# Altium project OpenFRA_V1.PrjPcb
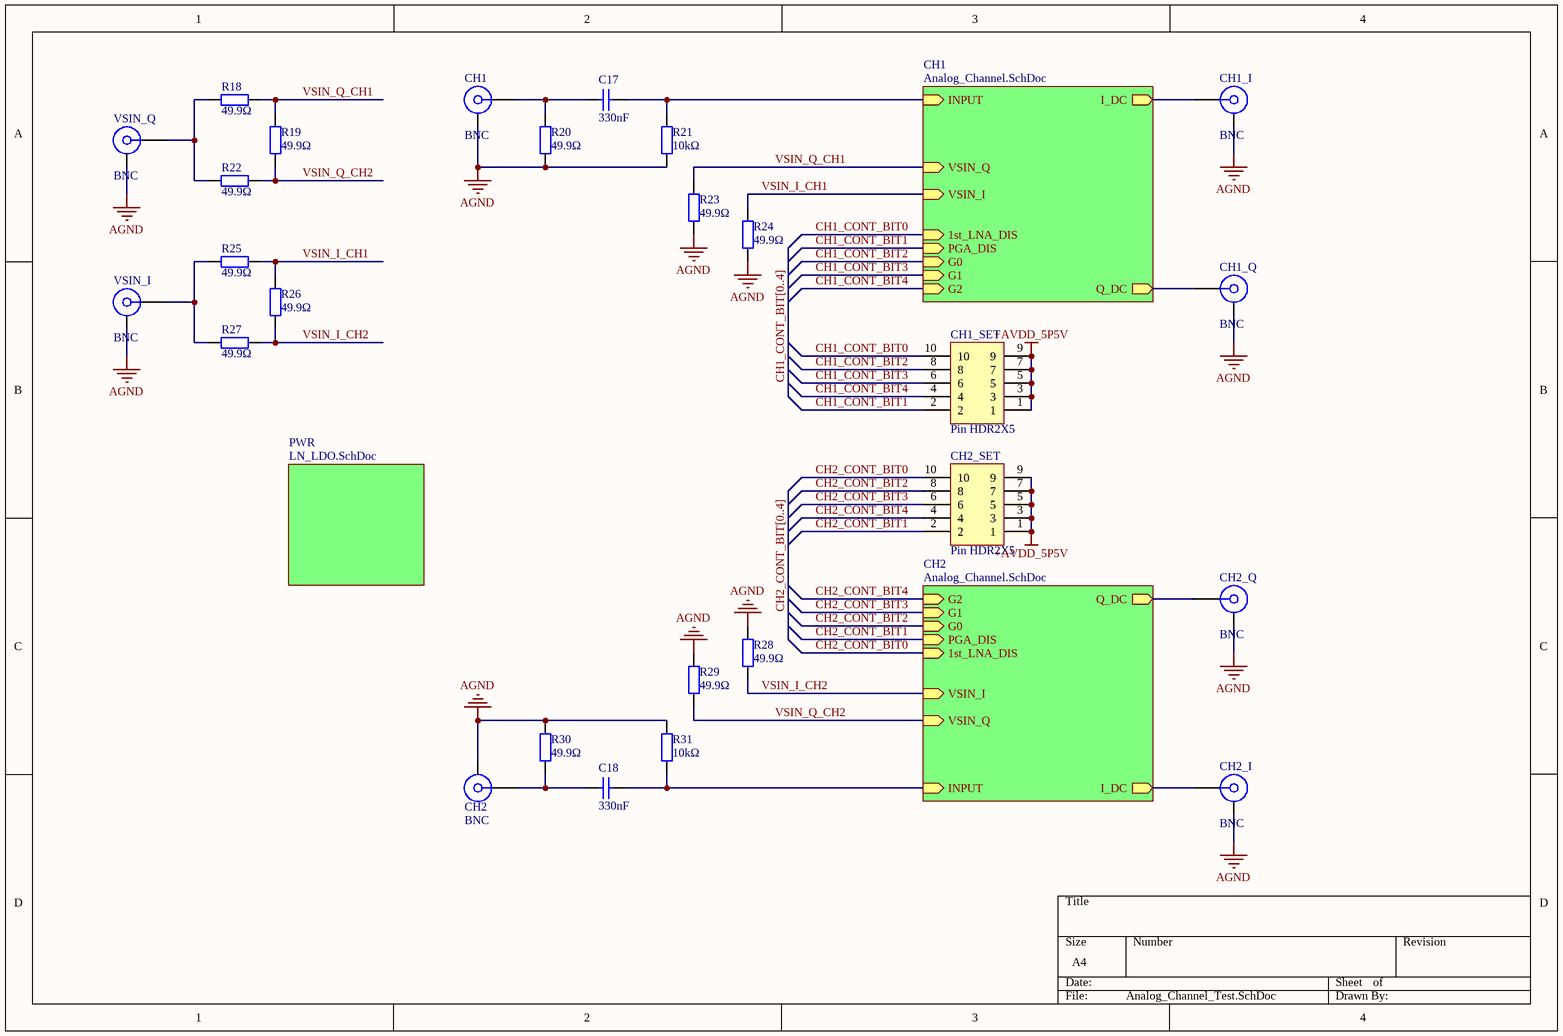
[diagram p0: Analog_Channel_Test.SchDoc]
7 sheets, 183 parts. Net scope: hierarchical (ports join the sheet entries above them; power ports are global).
Board files: PCB1.PcbDoc, PCB_AutoRoute.PcbDoc
Sheets:
  Analog_Channel_Test.SchDoc
    CH1 = Analog_Channel.SchDoc
      MIXER1 = AD835_Mixer.SchDoc
      MIXER2 = AD835_Mixer.SchDoc
      PGA1 = THS7001_PGA.SchDoc
      AMP1 = OPA847_LNA.SchDoc
    CH2 = Analog_Channel.SchDoc
      MIXER1 = AD835_Mixer.SchDoc
      MIXER2 = AD835_Mixer.SchDoc
      PGA1 = THS7001_PGA.SchDoc
      AMP1 = OPA847_LNA.SchDoc
    PWR = LN_LDO.SchDoc
  AD7768.SchDoc

## Sheet Analog_Channel_Test.SchDoc
size A4; SheetNumber: 1; SheetTotal: 7

### Parts
C17  330nF  [1206_C]
C18  330nF  [1206_C]
CH1  BNC  [BNC-TYCO_1-1337542-0]
CH1_I  BNC  [BNC-TYCO_1-1337542-0]
CH1_Q  BNC  [BNC-TYCO_1-1337542-0]
CH1_SET  Pin HDR2X5  [Pin HDR2X5/2.54mm-S]
CH2  BNC  [BNC-TYCO_1-1337542-0]
CH2_I  BNC  [BNC-TYCO_1-1337542-0]
CH2_Q  BNC  [BNC-TYCO_1-1337542-0]
CH2_SET  Pin HDR2X5  [Pin HDR2X5/2.54mm-S]
R18  49.9Ω  [0603_R]
R19  49.9Ω  [0603_R]
R20  49.9Ω  [0603_R]
R21  10kΩ  [0603_R]
R22  49.9Ω  [0603_R]
R23  49.9Ω  [0603_R]
R24  49.9Ω  [0603_R]
R25  49.9Ω  [0603_R]
R26  49.9Ω  [0603_R]
R27  49.9Ω  [0603_R]
R28  49.9Ω  [0603_R]
R29  49.9Ω  [0603_R]
R30  49.9Ω  [0603_R]
R31  10kΩ  [0603_R]
VSIN_I  BNC  [BNC-TYCO_1-1337542-0]
VSIN_Q  BNC  [BNC-TYCO_1-1337542-0]

### Sub-sheets
CH1 = Analog_Channel.SchDoc: VSIN_I (in), INPUT (in), I_DC (out), Q_DC (out), 1st_LNA_DIS (in), PGA_DIS (in), G0 (in), G1 (in), G2 (in), VSIN_Q (in)
CH2 = Analog_Channel.SchDoc: VSIN_I (in), INPUT (in), I_DC (out), Q_DC (out), 1st_LNA_DIS (in), PGA_DIS (in), G0 (in), G1 (in), G2 (in), VSIN_Q (in)
PWR = LN_LDO.SchDoc: no entries

### Nets
+AVDD_5P5V: CH1_SET.1 CH1_SET.3 CH1_SET.5 CH1_SET.7 CH1_SET.9 CH2_SET.1 CH2_SET.3 CH2_SET.5 CH2_SET.7 CH2_SET.9
AGND: CH1.MH CH1_I.MH CH1_Q.MH CH2.MH CH2_I.MH CH2_Q.MH R20.1 R21.1 R23.1 R24.1 R28.1 R29.1 R30.1 R31.1 VSIN_I.MH VSIN_Q.MH
CH1_CONT_BIT0: CH1_SET.10 ; sheet CH1/1st_LNA_DIS
CH1_CONT_BIT1: CH1_SET.2 ; sheet CH1/PGA_DIS
CH1_CONT_BIT2: CH1_SET.8 ; sheet CH1/G0
CH1_CONT_BIT3: CH1_SET.6 ; sheet CH1/G1
CH1_CONT_BIT4: CH1_SET.4 ; sheet CH1/G2
CH2_CONT_BIT0: CH2_SET.10 ; sheet CH2/1st_LNA_DIS
CH2_CONT_BIT1: CH2_SET.2 ; sheet CH2/PGA_DIS
CH2_CONT_BIT2: CH2_SET.8 ; sheet CH2/G0
CH2_CONT_BIT3: CH2_SET.6 ; sheet CH2/G1
CH2_CONT_BIT4: CH2_SET.4 ; sheet CH2/G2
VSIN_I_CH1: R24.2 R25.1 R26.1 ; sheet CH1/VSIN_I
VSIN_I_CH2: R26.2 R27.1 R28.2 ; sheet CH2/VSIN_I
VSIN_Q_CH1: R18.1 R19.1 R23.2 ; sheet CH1/VSIN_Q
VSIN_Q_CH2: R19.2 R22.1 R29.2 ; sheet CH2/VSIN_Q
NetC2_CH1_2: CH1_I.1 ; sheet CH1/I_DC
NetC2_CH2_2: CH2_I.1 ; sheet CH2/I_DC
NetC3_CH1_2: CH1_Q.1 ; sheet CH1/Q_DC
NetC3_CH2_2: CH2_Q.1 ; sheet CH2/Q_DC
NetC17_1: C17.1 CH1.1 R20.2
NetC17_2: C17.2 R21.2 ; sheet CH1/INPUT
NetC18_1: C18.1 CH2.1 R30.2
NetC18_2: C18.2 R31.2 ; sheet CH2/INPUT
NetR18_2: R18.2 R22.2 VSIN_Q.1
NetR25_2: R25.2 R27.2 VSIN_I.1

### Buses and harness runs
bus CH1_CONT_BIT[0..4]
bus CH2_CONT_BIT[0..4]

### Library data of the parts
C17 C18 = 1206 100nF (104) 10% 50V: 贴片电容; ComponentLink1Description: 供应商链接; ComponentLink1URL: http://www.szlcsc.com/product/details_25237.html; Package: 1206; Supplier: LC; SuppliersPartNumber: C24497
CH1 CH1_I CH1_Q CH2 CH2_I CH2_Q VSIN_I VSIN_Q = BNC: BNC-KE PIN 6.9mm distance; PartNumber: 51K101-400A4; Design Note: Footprint in library is a generic example - only application specific footprint delivers High Performance; DatasheetVersion: c00; PackageVersion: c00; PackageReference: 51K101-400A4; PackageDescription: 50R BNC Straight Jack, 12 x 12 x 15 mm; Mounting Technology: Through Hole; ComponentLink1Description: Manufacturer URL; ComponentLink1URL: http://www.rosenberger.de; ComponentLink2Description: Datasheet; ComponentLink2URL: http://rosenberger.de/ok/images/documents/db/51K101-400A4.pdf; ComponentLink3Description: Package Specification; ComponentLink3URL: http://rosenberger.de/ok/images/documents/db/51K101-400A4.pdf; ComponentLink4Description: URL Link1; ComponentLink4URL: Series Overview / Design Note:http://rosenberger.de/ok/images/documents/spez/51.pdf; ComponentLink5Description: Webshop / RFQ; ComponentLink5URL: http://www.rosenberger.com/en/contact/sales/
R18-R20 R22-R30 = 0603 49.9Ω (49R9) 1%: 贴片电阻; ComponentLink1Description: 供应商链接; ComponentLink1URL: http://www.szlcsc.com/product/details_23912.html; Package: 0603; Supplier: LC; SuppliersPartNumber: C23185
R21 R31 = 0603 10KΩ (1002) 1%: 贴片电阻; ComponentLink1Description: 供应商链接; ComponentLink1URL: http://www.szlcsc.com/product/details_26547.html; Package: 0603; Supplier: LC; SuppliersPartNumber: C25804

## Sheet Analog_Channel.SchDoc
size A4; SheetNumber: 2; SheetTotal: 6
Used 2 times, as channels CH1, CH2. Parts and nets are listed once, with the designators drawn on the sheet.
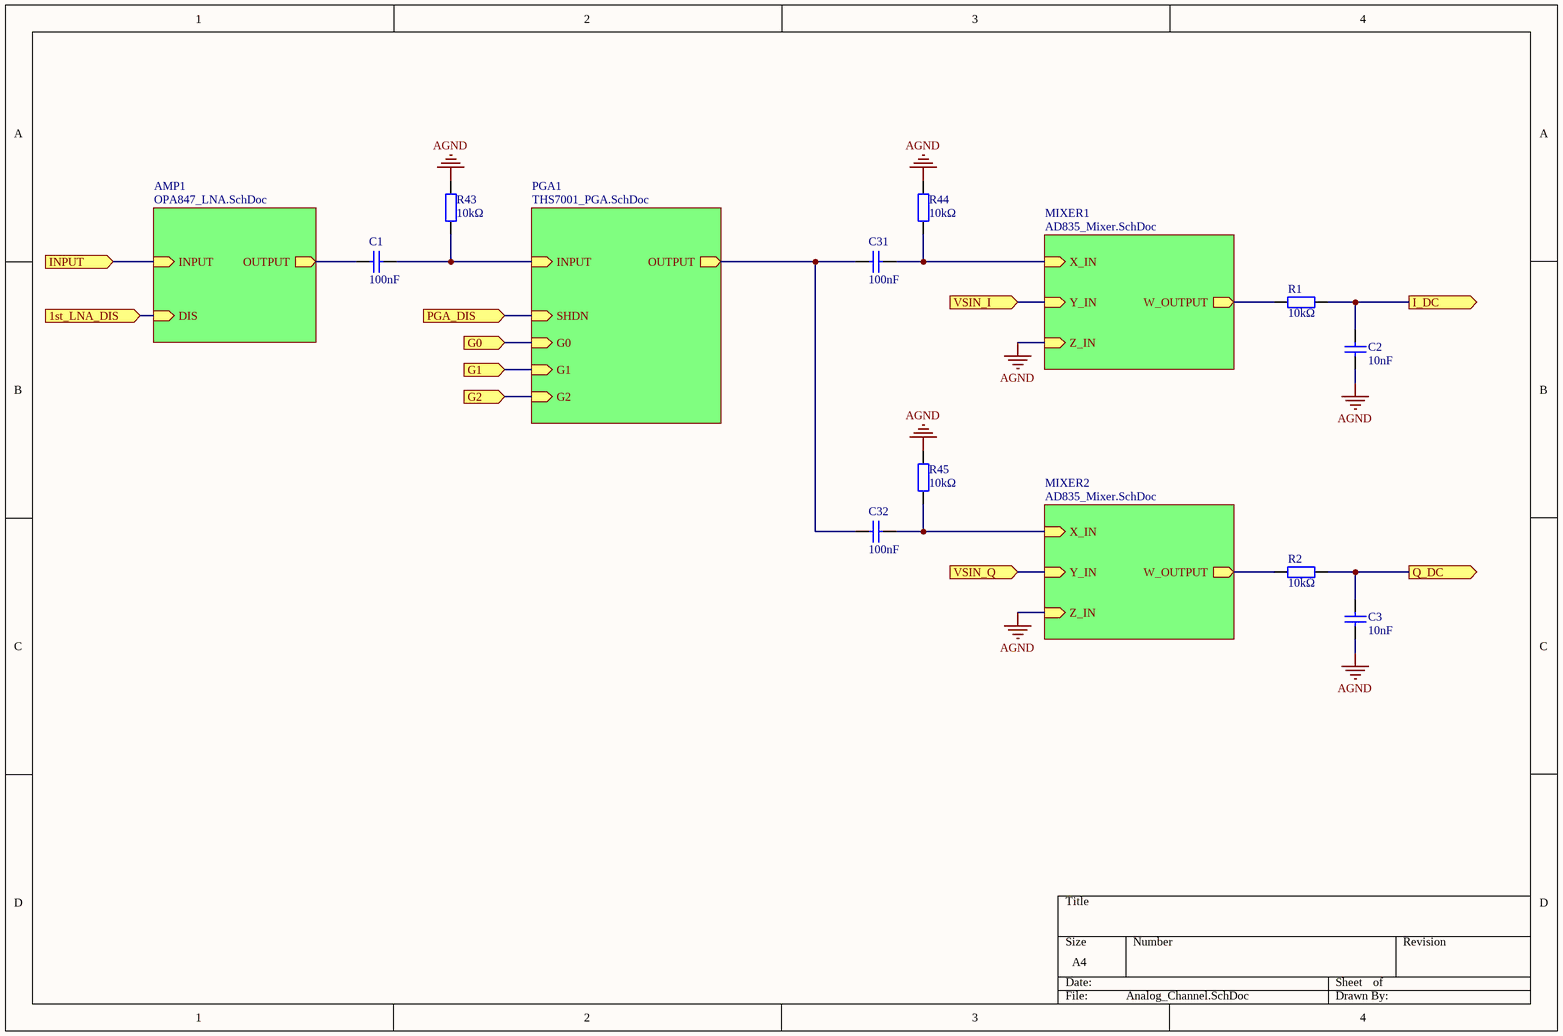
[diagram p1: Analog_Channel.SchDoc]

### Parts
C1  100nF  [0805_C]
C2  10nF  [0603_C]
C3  10nF  [0603_C]
C31  100nF  [0805_C]
C32  100nF  [0805_C]
R1  10kΩ  [0603_R]
R2  10kΩ  [0603_R]
R43  10kΩ  [0603_R]
R44  10kΩ  [0603_R]
R45  10kΩ  [0603_R]

### Sub-sheets
AMP1 = OPA847_LNA.SchDoc: INPUT (in), OUTPUT (out), DIS (in)
MIXER1 = AD835_Mixer.SchDoc: X_IN (in), Y_IN (in), Z_IN (in), W_OUTPUT (out)
MIXER2 = AD835_Mixer.SchDoc: X_IN (in), Y_IN (in), Z_IN (in), W_OUTPUT (out)
PGA1 = THS7001_PGA.SchDoc: G0 (in), G1 (in), G2 (in), SHDN (in), OUTPUT (out), INPUT (in)

### Ports
1st_LNA_DIS (in), G0 (in), G1 (in), G2 (in), I_DC (out), INPUT (in), PGA_DIS (in), Q_DC (out), VSIN_I (in), VSIN_Q (in)

### Nets
AGND: C2.1 C3.1 R43.1 R44.1 R45.1 ; sheet MIXER1/Z_IN, sheet MIXER2/Z_IN
1st_LNA_DIS: port 1st_LNA_DIS, sheet AMP1/DIS
G0: port G0, sheet PGA1/G0
G1: port G1, sheet PGA1/G1
G2: port G2, sheet PGA1/G2
I_DC: C2.2 R1.1 ; port I_DC
INPUT: port INPUT, sheet AMP1/INPUT
PGA_DIS: port PGA_DIS, sheet PGA1/SHDN
Q_DC: C3.2 R2.1 ; port Q_DC
VSIN_I: port VSIN_I, sheet MIXER1/Y_IN
VSIN_Q: port VSIN_Q, sheet MIXER2/Y_IN
NetC1_1: C1.1 ; sheet AMP1/OUTPUT
NetC1_2: C1.2 R43.2 ; sheet PGA1/INPUT
NetC31_1: C31.1 C32.1 ; sheet PGA1/OUTPUT
NetC31_2: C31.2 R44.2 ; sheet MIXER1/X_IN
NetC32_2: C32.2 R45.2 ; sheet MIXER2/X_IN
NetR1_2: R1.2 ; sheet MIXER1/W_OUTPUT
NetR2_2: R2.2 ; sheet MIXER2/W_OUTPUT

### Channels
CH1: designators end in _CH1; ports 1st_LNA_DIS=CH1_CONT_BIT0 G0=CH1_CONT_BIT2 G1=CH1_CONT_BIT3 G2=CH1_CONT_BIT4 I_DC=NetC2_CH1_2 INPUT=NetC17_2 PGA_DIS=CH1_CONT_BIT1 Q_DC=NetC3_CH1_2 VSIN_I=VSIN_I_CH1 VSIN_Q=VSIN_Q_CH1
CH2: designators end in _CH2; ports 1st_LNA_DIS=CH2_CONT_BIT0 G0=CH2_CONT_BIT2 G1=CH2_CONT_BIT3 G2=CH2_CONT_BIT4 I_DC=NetC2_CH2_2 INPUT=NetC18_2 PGA_DIS=CH2_CONT_BIT1 Q_DC=NetC3_CH2_2 VSIN_I=VSIN_I_CH2 VSIN_Q=VSIN_Q_CH2

### Library data of the parts
C1 C31 C32 = 0805 100nF(104) 10% 50V: 贴片电容; ComponentLink1Description: 供应商链接; ComponentLink1URL: http://www.szlcsc.com/product/details_50686.html; Package: 0805; Supplier: LC; SuppliersPartNumber: C49678
C2 C3 = 0603 10nF (103) 10% 50V: 贴片电容; ComponentLink1Description: 供应商链接; ComponentLink1URL: http://www.szlcsc.com/product/details_58143.html; Package: 0603; Supplier: LC; SuppliersPartNumber: C57112
R1 R2 R43-R45 = 0603 10KΩ (1002) 1%: 贴片电阻; ComponentLink1Description: 供应商链接; ComponentLink1URL: http://www.szlcsc.com/product/details_26547.html; Package: 0603; Supplier: LC; SuppliersPartNumber: C25804

## Sheet AD835_Mixer.SchDoc
size A4; SheetNumber: 4; SheetTotal: 7
Used 4 times, as channels CH1/MIXER1, CH1/MIXER2, CH2/MIXER1, CH2/MIXER2. Parts and nets are listed once, with the designators drawn on the sheet.
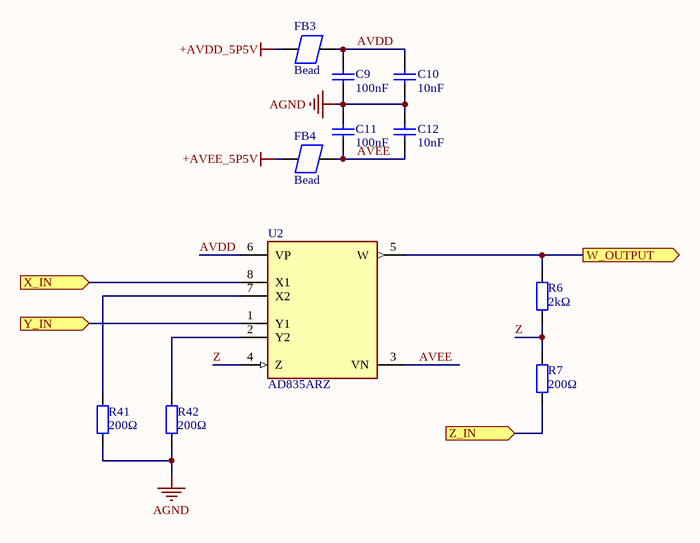
[diagram p2: AD835_Mixer.SchDoc]

### Parts
C9  100nF  [0603_C]
C10  10nF  [0603_C]
C11  100nF  [0603_C]
C12  10nF  [0603_C]
FB3  Bead  [0805_L]
FB4  Bead  [0805_L]
R6  2kΩ  [0603_R]
R7  200Ω  [0603_R]
R41  200Ω  [0603_R]
R42  200Ω  [0603_R]
U2  AD835ARZ  [FP-R-8-IPC_A]

### Ports
W_OUTPUT (out), X_IN (in), Y_IN (in), Z_IN (in)

### Nets
+AVDD_5P5V: FB3.1
+AVEE_5P5V: FB4.1
AGND: C9.1 C10.1 C11.1 C12.1 R41.1 R42.1
AVDD: C9.2 C10.2 FB3.2 U2.6(VP)
AVEE: C11.2 C12.2 FB4.2 U2.3(VN)
W_OUTPUT: R6.2 U2.5(W) ; port W_OUTPUT
X_IN: U2.8(X1) ; port X_IN
Y_IN: U2.1(Y1) ; port Y_IN
Z: R6.1 R7.2 U2.4(Z)
Z_IN: R7.1 ; port Z_IN
NetR41_2: R41.2 U2.7(X2)
NetR42_2: R42.2 U2.2(Y2)

### Channels
CH1/MIXER1: designators end in _CH1_MIXER1; ports W_OUTPUT=NetR1_CH1_2 X_IN=NetC31_CH1_2 Y_IN=VSIN_I_CH1 Z_IN=AGND
CH1/MIXER2: designators end in _CH1_MIXER2; ports W_OUTPUT=NetR2_CH1_2 X_IN=NetC32_CH1_2 Y_IN=VSIN_Q_CH1 Z_IN=AGND
CH2/MIXER1: designators end in _CH2_MIXER1; ports W_OUTPUT=NetR1_CH2_2 X_IN=NetC31_CH2_2 Y_IN=VSIN_I_CH2 Z_IN=AGND
CH2/MIXER2: designators end in _CH2_MIXER2; ports W_OUTPUT=NetR2_CH2_2 X_IN=NetC32_CH2_2 Y_IN=VSIN_Q_CH2 Z_IN=AGND

### Library data of the parts
C9 C11 = 0603 100nF (104) 10% 50V: 贴片电容; ComponentLink1Description: 供应商链接; ComponentLink1URL: http://www.szlcsc.com/product/details_15331.html; Package: 0603; Supplier: LC; SuppliersPartNumber: C14663
C10 C12 = 0603 10nF (103) 10% 50V: 贴片电容; ComponentLink1Description: 供应商链接; ComponentLink1URL: http://www.szlcsc.com/product/details_58143.html; Package: 0603; Supplier: LC; SuppliersPartNumber: C57112
R6 = 0603 2KΩ (2001) 1%: 贴片电阻; ComponentLink1Description: 供应商链接; ComponentLink1URL: http://www.szlcsc.com/product/details_23702.html; Package: 0603; Supplier: LC; SuppliersPartNumber: C22975
R7 R41 R42 = 0603 200Ω (2000) 1%: 贴片电阻; ComponentLink1Description: 供应商链接; ComponentLink1URL: http://www.szlcsc.com/product/details_8708.html; Package: 0603; Supplier: LC; SuppliersPartNumber: C8218
U2 = CMP-09114-000033-1: ANALOG MULTIPLIER OR DIVIDER, 25; Min Dual Supply Voltage: 4.5V; Number of Amplifiers: 3; Nominal Supply Current: 16mA; Max Dual Supply Voltage: 5.5V; Max Power Dissipation: 300mW; Number of Circuits: 1; Operating Supply Current: 25mA; Number of Channels: 2; Max Input Voltage: 1V; -3db Bandwidth: 250MHz; Dual Supply Voltage: 5V; Slew Rate: 1000V/µs; Accuracy: 2%; Number of Bits: 4; Settling Time: 20ns; Output Voltage: 2.5V; Contact Plating: Tin; Height: 1.5mm; Number of Elements: 1; Min Supply Voltage: 4.5V; Mount: Surface Mount; Operating Supply Voltage: 5V; Package Quantity: 1; Max Frequency: 250MHz; Lead Free: Contains Lead; Length: 5mm; Min Operating Temperature: -40°C; Supply Current: 16mA; Max Operating Temperature: 85°C; Width: 4mm; Max Supply Voltage: 5.5V; RoHS Compliant: Yes; Radiation Hardening: No; REACH SVHC: No SVHC; Series: -; Number of Pins: 8; Case/Package: SOIC; Packaging: Rail/Tube

## Sheet THS7001_PGA.SchDoc
size A4; SheetNumber: 5; SheetTotal: 7
Used 2 times, as channels CH1/PGA1, CH2/PGA1. Parts and nets are listed once, with the designators drawn on the sheet.
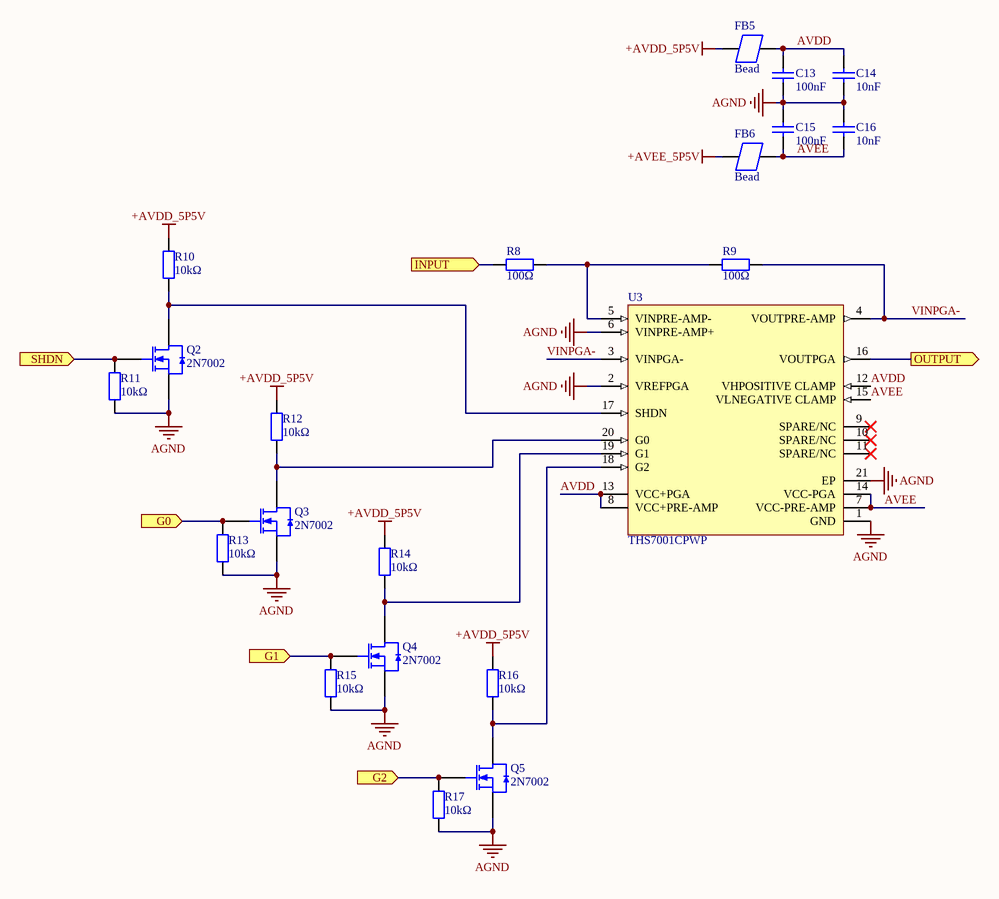
[diagram p3: THS7001_PGA.SchDoc]

### Parts
C13  100nF  [0603_C]
C14  10nF  [0603_C]
C15  100nF  [0603_C]
C16  10nF  [0603_C]
FB5  Bead  [0805_L]
FB6  Bead  [0805_L]
Q2  2N7002  [SOT-23(SOT-23-3)]
Q3  2N7002  [SOT-23(SOT-23-3)]
Q4  2N7002  [SOT-23(SOT-23-3)]
Q5  2N7002  [SOT-23(SOT-23-3)]
R8  100Ω  [0603_R]
R9  100Ω  [0603_R]
R10  10kΩ  [0603_R]
R11  10kΩ  [0603_R]
R12  10kΩ  [0603_R]
R13  10kΩ  [0603_R]
R14  10kΩ  [0603_R]
R15  10kΩ  [0603_R]
R16  10kΩ  [0603_R]
R17  10kΩ  [0603_R]
U3  THS7001CPWP  [PWP0020D_M]

### Ports
G0 (in), G1 (in), G2 (in), INPUT (in), OUTPUT (out), SHDN (in)

### Nets
+AVDD_5P5V: FB5.1 R10.2 R12.2 R14.2 R16.2
+AVEE_5P5V: FB6.1
AGND: C13.1 C14.1 C15.1 C16.1 Q2.2(S) Q3.2(S) Q4.2(S) Q5.2(S) R11.1 R13.1 R15.1 R17.1 U3.1(GND) U3.2(VREFPGA) U3.6(VINPRE-AMP+) U3.21(EP)
AVDD: C13.2 C14.2 FB5.2 U3.8(VCC+PRE-AMP) U3.12(VHPOSITIVE_CLAMP) U3.13(VCC+PGA)
AVEE: C15.2 C16.2 FB6.2 U3.7(VCC-PRE-AMP) U3.14(VCC-PGA) U3.15(VLNEGATIVE_CLAMP)
G0: Q3.1(G) R13.2 ; port G0
G1: Q4.1(G) R15.2 ; port G1
G2: Q5.1(G) R17.2 ; port G2
INPUT: R8.1 ; port INPUT
OUTPUT: U3.16(VOUTPGA) ; port OUTPUT
SHDN: Q2.1(G) R11.2 ; port SHDN
VINPGA-: R9.2 U3.3(VINPGA-) U3.4(VOUTPRE-AMP)
NetQ2_3: Q2.3(D) R10.1 U3.17(SHDN)
NetQ3_3: Q3.3(D) R12.1 U3.20(G0)
NetQ4_3: Q4.3(D) R14.1 U3.19(G1)
NetQ5_3: Q5.3(D) R16.1 U3.18(G2)
NetR8_2: R8.2 R9.1 U3.5(VINPRE-AMP-)

Not connected (* = marked no-connect by the designer): U3 9(SPARE/NC)* 10(SPARE/NC)* 11(SPARE/NC)*

### Channels
CH1/PGA1: designators end in _CH1_PGA1; ports G0=CH1_CONT_BIT2 G1=CH1_CONT_BIT3 G2=CH1_CONT_BIT4 INPUT=NetC1_CH1_2 OUTPUT=NetC31_CH1_1 SHDN=CH1_CONT_BIT1
CH2/PGA1: designators end in _CH2_PGA1; ports G0=CH2_CONT_BIT2 G1=CH2_CONT_BIT3 G2=CH2_CONT_BIT4 INPUT=NetC1_CH2_2 OUTPUT=NetC31_CH2_1 SHDN=CH2_CONT_BIT1

### Library data of the parts
C13 C15 = 0603 100nF (104) 10% 50V: 贴片电容; ComponentLink1Description: 供应商链接; ComponentLink1URL: http://www.szlcsc.com/product/details_15331.html; Package: 0603; Supplier: LC; SuppliersPartNumber: C14663
C14 C16 = 0603 10nF (103) 10% 50V: 贴片电容; ComponentLink1Description: 供应商链接; ComponentLink1URL: http://www.szlcsc.com/product/details_58143.html; Package: 0603; Supplier: LC; SuppliersPartNumber: C57112
Q2-Q5 = 2N7002 7002: MOS(场效应管); ComponentLink1Description: 供应商链接; ComponentLink1URL: http://www.szlcsc.com/product/details_9040.html; Package: SOT-23(SOT-23-3); Supplier: LC; SuppliersPartNumber: C8545
R8 R9 = 0603 100Ω (1000) 1%: 贴片电阻; ComponentLink1Description: 供应商链接; ComponentLink1URL: http://www.szlcsc.com/product/details_23502.html; Package: 0603; Supplier: LC; SuppliersPartNumber: C22775
R10-R17 = 0603 10KΩ (1002) 1%: 贴片电阻; ComponentLink1Description: 供应商链接; ComponentLink1URL: http://www.szlcsc.com/product/details_26547.html; Package: 0603; Supplier: LC; SuppliersPartNumber: C25804
U3 = CMP-0988-00128-2: 70-MHz High-Speed Programmable-Gain Amplifier, 0 to 70 degC, 20-pin SOP (PWP20), Green (RoHS & no Sb/Br); Manufacturer: Texas Instruments; Disable: TRUE; Vio(Max)(mV): 7; SubFamily: Variable Gain Amplifier; Iib(Max)(nA): 6000; BW @ Acl(MHz): 100; Vn at Flatband(Typ)(nV/rtHz): 1.7; Slew Rate(Typ)(V/us): 85; Vs(Min)(V): 9; Number of Channels: 1; Vs(Max)(V): 32; ComponentLink1URL: http://www.ti.com/; ComponentLink2Description: Datasheet; ComponentLink3Description: Package Specification; PackageVersion: 4073225-4/I, 05/2011; PackageDescription: 20-Pin Plastic Small Outline, Body 4.4 x 6.5 mm, Pitch 0.65 mm; ComponentLink2URL: http://www.ti.com/general/docs/lit/getliterature.tsp?genericPartNumber=THS7001&fileType=pdf; Code_JEDEC: MO-153; Eco-Plan: Green (RoHS & no Sb/Br); DatasheetVersion: SLOS214C; ComponentLink1Description: Manufacturer URL; Mounting Technology: Surface Mount; ComponentLink3URL: http://www.ti.com/lit/ml/mhts001g/mhts001g.pdf; PartNumber: THS7001CPWP; PackageReference: PWP0020D

## Sheet OPA847_LNA.SchDoc
size A4; SheetNumber: 3; SheetTotal: 7
Used 2 times, as channels CH1/AMP1, CH2/AMP1. Parts and nets are listed once, with the designators drawn on the sheet.
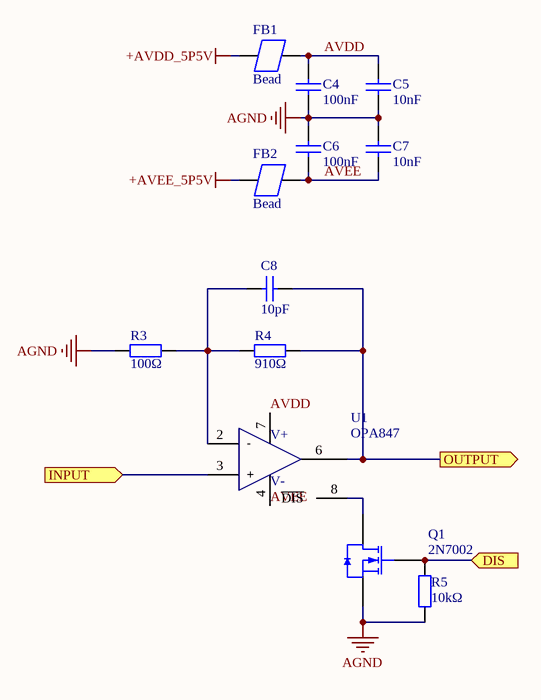
[diagram p4: OPA847_LNA.SchDoc]

### Parts
C4  100nF  [0603_C]
C5  10nF  [0603_C]
C6  100nF  [0603_C]
C7  10nF  [0603_C]
C8  10pF  [0603_C]
FB1  Bead  [0805_L]
FB2  Bead  [0805_L]
Q1  2N7002  [SOT-23(SOT-23-3)]
R3  100Ω  [0603_R]
R4  910Ω  [0603_R]
R5  10kΩ  [0603_R]
U1  OPA847  [SOIC127P600X175-8M]

### Ports
DIS (in), INPUT (in), OUTPUT (out)

### Nets
+AVDD_5P5V: FB1.1
+AVEE_5P5V: FB2.1
AGND: C4.1 C5.1 C6.1 C7.1 Q1.2(S) R3.1 R5.1
AVDD: C4.2 C5.2 FB1.2 U1.7(VCC+)
AVEE: C6.2 C7.2 FB2.2 U1.4(VCC-)
DIS: Q1.1(G) R5.2 ; port DIS
INPUT: U1.3 ; port INPUT
OUTPUT: C8.2 R4.2 U1.6 ; port OUTPUT
NetC8_1: C8.1 R3.2 R4.1 U1.2
NetQ1_3: Q1.3(D) U1.8(~{DIS})

### Channels
CH1/AMP1: designators end in _CH1_AMP1; ports DIS=CH1_CONT_BIT0 INPUT=NetC17_2 OUTPUT=NetC1_CH1_1
CH2/AMP1: designators end in _CH2_AMP1; ports DIS=CH2_CONT_BIT0 INPUT=NetC18_2 OUTPUT=NetC1_CH2_1

### Notes on the sheet
- (in symbol OPA847) V+; -; +; V-

### Library data of the parts
C4 C6 = 0603 100nF (104) 10% 50V: 贴片电容; ComponentLink1Description: 供应商链接; ComponentLink1URL: http://www.szlcsc.com/product/details_15331.html; Package: 0603; Supplier: LC; SuppliersPartNumber: C14663
C5 C7 = 0603 10nF (103) 10% 50V: 贴片电容; ComponentLink1Description: 供应商链接; ComponentLink1URL: http://www.szlcsc.com/product/details_58143.html; Package: 0603; Supplier: LC; SuppliersPartNumber: C57112
C8 = 0603 10pF (100) 5% 50V: 贴片电容; ComponentLink1Description: 供应商链接; ComponentLink1URL: http://www.szlcsc.com/product/details_1986.html; Package: 0603; Supplier: LC; SuppliersPartNumber: C1634
Q1 = 2N7002 7002: MOS(场效应管); ComponentLink1Description: 供应商链接; ComponentLink1URL: http://www.szlcsc.com/product/details_9040.html; Package: SOT-23(SOT-23-3); Supplier: LC; SuppliersPartNumber: C8545
R3 = 0603 100Ω (1000) 1%: 贴片电阻; ComponentLink1Description: 供应商链接; ComponentLink1URL: http://www.szlcsc.com/product/details_23502.html; Package: 0603; Supplier: LC; SuppliersPartNumber: C22775
R4 = 0603 910Ω (9100) 1%: 贴片电阻; ComponentLink1Description: 供应商链接; ComponentLink1URL: http://www.szlcsc.com/product/details_23991.html; Package: 0603; Supplier: LC; SuppliersPartNumber: C23264
R5 = 0603 10KΩ (1002) 1%: 贴片电阻; ComponentLink1Description: 供应商链接; ComponentLink1URL: http://www.szlcsc.com/product/details_26547.html; Package: 0603; Supplier: LC; SuppliersPartNumber: C25804
U1 = OPA847: Wideband, Ultra-Low Noise, Voltage-Feedback OPERATIONAL AMPLIFIER with Shutdown

## Sheet LN_LDO.SchDoc
size A4; SheetNumber: 6; SheetTotal: 7
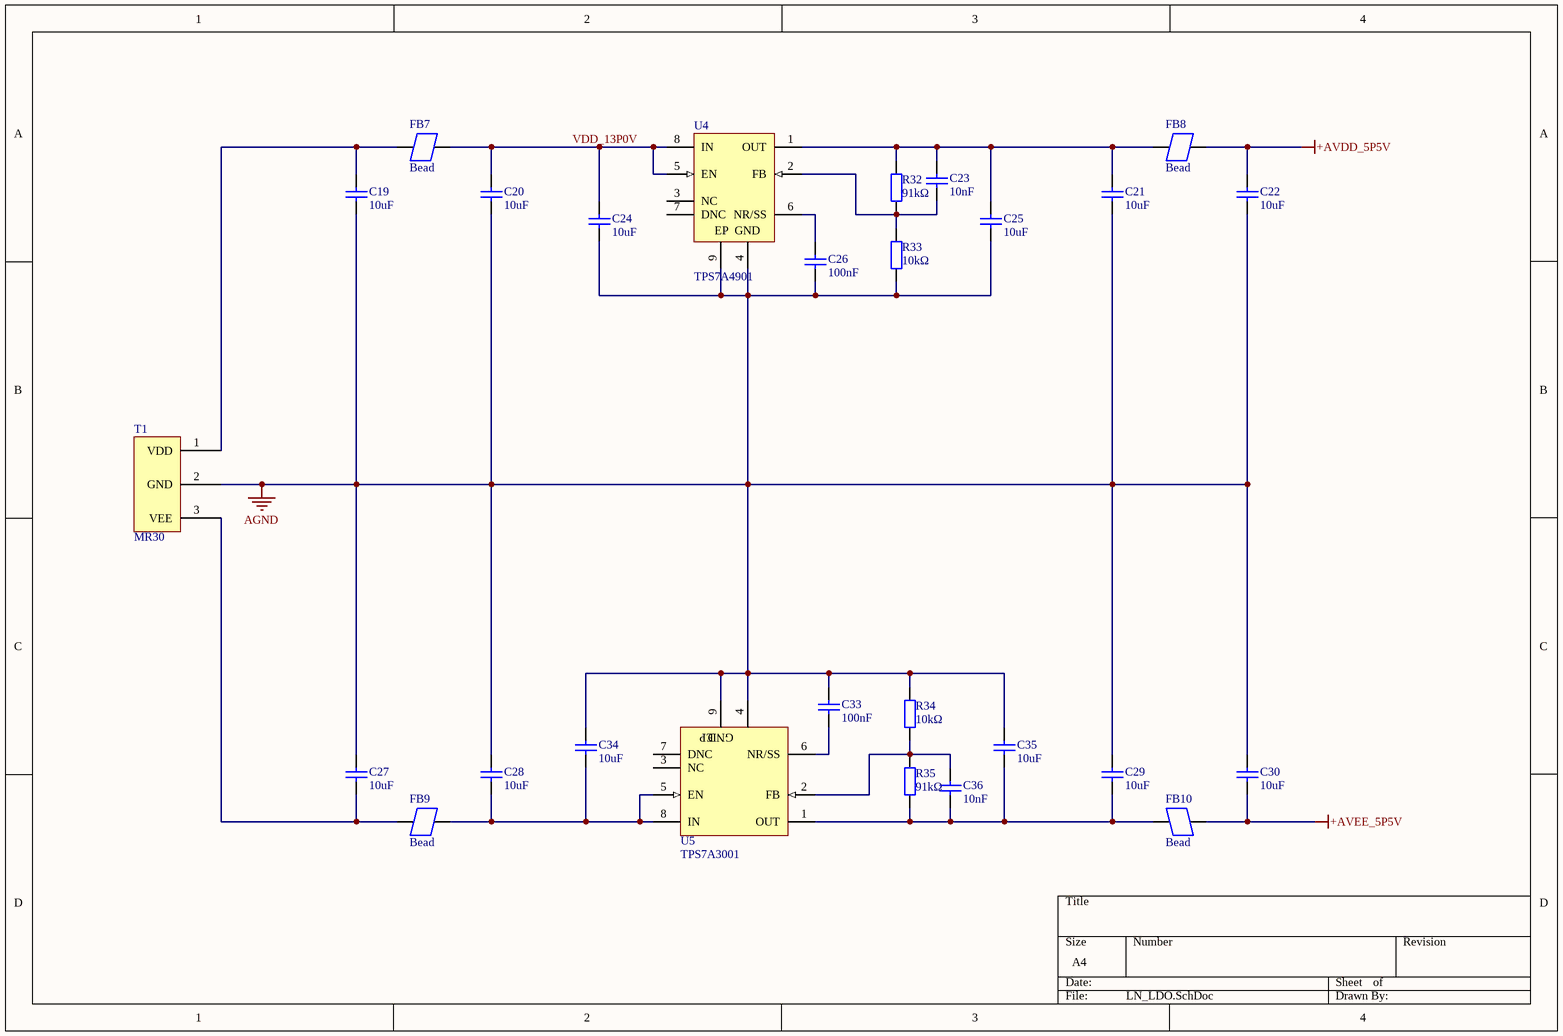
[diagram p5: LN_LDO.SchDoc]

### Parts
C19  10uF  [0805_C]
C20  10uF  [0805_C]
C21  10uF  [0805_C]
C22  10uF  [0805_C]
C23  10nF  [0603_C]
C24  10uF  [0805_C]
C25  10uF  [0805_C]
C26  100nF  [0603_C]
C27  10uF  [0805_C]
C28  10uF  [0805_C]
C29  10uF  [0805_C]
C30  10uF  [0805_C]
C33  100nF  [0603_C]
C34  10uF  [0805_C]
C35  10uF  [0805_C]
C36  10nF  [0603_C]
FB7  Bead  [0805_L]
FB8  Bead  [0805_L]
FB9  Bead  [0805_L]
FB10  Bead  [0805_L]
R32  91kΩ  [0603_R]
R33  10kΩ  [0603_R]
R34  10kΩ  [0603_R]
R35  91kΩ  [0603_R]
T1  MR30  [MR30PW-M]
U4  TPS7A4901  [DGN0008D_L]
U5  TPS7A3001  [DGN0008D_L]

### Nets
+AVDD_5P5V: C22.2 FB8.1
+AVEE_5P5V: C30.1 FB10.1
AGND: C19.1 C20.1 C21.1 C22.1 C24.1 C25.1 C26.1 C27.2 C28.2 C29.2 C30.2 C33.1 C34.1 C35.1 R33.1 R34.1 T1.2(GND) U4.4(GND) U4.9(EP) U5.4(GND) U5.9(EP)
VDD_13P0V: C20.2 C24.2 FB7.1 U4.5(EN) U4.8(IN)
NetC19_2: C19.2 FB7.2 T1.1(VDD)
NetC21_2: C21.2 C23.2 C25.2 FB8.2 R32.2 U4.1(OUT)
NetC23_1: C23.1 R32.1 R33.2 U4.2(FB)
NetC26_2: C26.2 U4.6(NR/SS)
NetC27_1: C27.1 FB9.1 T1.3(VEE)
NetC28_1: C28.1 C34.2 FB9.2 U5.5(EN) U5.8(IN)
NetC29_1: C29.1 C35.2 C36.2 FB10.2 R35.2 U5.1(OUT)
NetC33_2: C33.2 U5.6(NR/SS)
NetC36_1: C36.1 R34.2 R35.1 U5.2(FB)

Not connected (* = marked no-connect by the designer): U4 3(NC) 7(DNC); U5 3(NC) 7(DNC)

### Library data of the parts
C19-C22 C24 C25 C27-C30 C34 C35 = 0805 10uF (106) 10% 25V: 贴片电容; ComponentLink1Description: 供应商链接; ComponentLink1URL: http://www.szlcsc.com/product/details_16532.html; Package: 0805; Supplier: LC; SuppliersPartNumber: C15850
C23 C36 = 0603 10nF (103) 10% 50V: 贴片电容; ComponentLink1Description: 供应商链接; ComponentLink1URL: http://www.szlcsc.com/product/details_58143.html; Package: 0603; Supplier: LC; SuppliersPartNumber: C57112
C26 C33 = 0603 100nF (104) 10% 50V: 贴片电容; ComponentLink1Description: 供应商链接; ComponentLink1URL: http://www.szlcsc.com/product/details_15331.html; Package: 0603; Supplier: LC; SuppliersPartNumber: C14663
R32 R35 = 0603 91KΩ (9102) 1%: 贴片电阻; ComponentLink1Description: 供应商链接; ComponentLink1URL: http://www.szlcsc.com/product/details_23992.html; Package: 0603; Supplier: LC; SuppliersPartNumber: C23265
R33 R34 = 0603 10KΩ (1002) 1%: 贴片电阻; ComponentLink1Description: 供应商链接; ComponentLink1URL: http://www.szlcsc.com/product/details_26547.html; Package: 0603; Supplier: LC; SuppliersPartNumber: C25804

## Sheet AD7768.SchDoc
size A4; SheetNumber: 7; SheetTotal: 7

## Nets that join several sheets
+AVDD_5P5V: Analog_Channel_Test (10 pins), CH1/MIXER1 (FB3_CH1_MIXER1.1), CH1/MIXER2 (FB3_CH1_MIXER2.1), CH1/PGA1 (5 pins), CH1/AMP1 (FB1_CH1_AMP1.1), CH2/MIXER1 (FB3_CH2_MIXER1.1), CH2/MIXER2 (FB3_CH2_MIXER2.1), CH2/PGA1 (5 pins), CH2/AMP1 (FB1_CH2_AMP1.1), LN_LDO (C22.2 FB8.1)
+AVEE_5P5V: CH1/MIXER1 (FB4_CH1_MIXER1.1), CH1/MIXER2 (FB4_CH1_MIXER2.1), CH1/PGA1 (FB6_CH1_PGA1.1), CH1/AMP1 (FB2_CH1_AMP1.1), CH2/MIXER1 (FB4_CH2_MIXER1.1), CH2/MIXER2 (FB4_CH2_MIXER2.1), CH2/PGA1 (FB6_CH2_PGA1.1), CH2/AMP1 (FB2_CH2_AMP1.1), LN_LDO (C30.1 FB10.1)
AGND: Analog_Channel_Test (16 pins), CH1 (5 pins), CH1/MIXER1 (7 pins), CH1/MIXER2 (7 pins), CH1/PGA1 (16 pins), CH1/AMP1 (7 pins), CH2 (5 pins), CH2/MIXER1 (7 pins), CH2/MIXER2 (7 pins), CH2/PGA1 (16 pins), CH2/AMP1 (7 pins), LN_LDO (21 pins)
CH1_CONT_BIT0: Analog_Channel_Test (CH1_SET.10), CH1/AMP1 (Q1_CH1_AMP1.1 R5_CH1_AMP1.2)
CH1_CONT_BIT1: Analog_Channel_Test (CH1_SET.2), CH1/PGA1 (Q2_CH1_PGA1.1 R11_CH1_PGA1.2)
CH1_CONT_BIT2: Analog_Channel_Test (CH1_SET.8), CH1/PGA1 (Q3_CH1_PGA1.1 R13_CH1_PGA1.2)
CH1_CONT_BIT3: Analog_Channel_Test (CH1_SET.6), CH1/PGA1 (Q4_CH1_PGA1.1 R15_CH1_PGA1.2)
CH1_CONT_BIT4: Analog_Channel_Test (CH1_SET.4), CH1/PGA1 (Q5_CH1_PGA1.1 R17_CH1_PGA1.2)
CH2_CONT_BIT0: Analog_Channel_Test (CH2_SET.10), CH2/AMP1 (Q1_CH2_AMP1.1 R5_CH2_AMP1.2)
CH2_CONT_BIT1: Analog_Channel_Test (CH2_SET.2), CH2/PGA1 (Q2_CH2_PGA1.1 R11_CH2_PGA1.2)
CH2_CONT_BIT2: Analog_Channel_Test (CH2_SET.8), CH2/PGA1 (Q3_CH2_PGA1.1 R13_CH2_PGA1.2)
CH2_CONT_BIT3: Analog_Channel_Test (CH2_SET.6), CH2/PGA1 (Q4_CH2_PGA1.1 R15_CH2_PGA1.2)
CH2_CONT_BIT4: Analog_Channel_Test (CH2_SET.4), CH2/PGA1 (Q5_CH2_PGA1.1 R17_CH2_PGA1.2)
NetC1_CH1_1: CH1 (C1_CH1.1), CH1/AMP1 (C8_CH1_AMP1.2 R4_CH1_AMP1.2 U1_CH1_AMP1.6)
NetC1_CH1_2: CH1 (C1_CH1.2 R43_CH1.2), CH1/PGA1 (R8_CH1_PGA1.1)
NetC1_CH2_1: CH2 (C1_CH2.1), CH2/AMP1 (C8_CH2_AMP1.2 R4_CH2_AMP1.2 U1_CH2_AMP1.6)
NetC1_CH2_2: CH2 (C1_CH2.2 R43_CH2.2), CH2/PGA1 (R8_CH2_PGA1.1)
NetC2_CH1_2: Analog_Channel_Test (CH1_I.1), CH1 (C2_CH1.2 R1_CH1.1)
NetC2_CH2_2: Analog_Channel_Test (CH2_I.1), CH2 (C2_CH2.2 R1_CH2.1)
NetC3_CH1_2: Analog_Channel_Test (CH1_Q.1), CH1 (C3_CH1.2 R2_CH1.1)
NetC3_CH2_2: Analog_Channel_Test (CH2_Q.1), CH2 (C3_CH2.2 R2_CH2.1)
NetC17_2: Analog_Channel_Test (C17.2 R21.2), CH1/AMP1 (U1_CH1_AMP1.3)
NetC18_2: Analog_Channel_Test (C18.2 R31.2), CH2/AMP1 (U1_CH2_AMP1.3)
NetC31_CH1_1: CH1 (C31_CH1.1 C32_CH1.1), CH1/PGA1 (U3_CH1_PGA1.16)
NetC31_CH1_2: CH1 (C31_CH1.2 R44_CH1.2), CH1/MIXER1 (U2_CH1_MIXER1.8)
NetC31_CH2_1: CH2 (C31_CH2.1 C32_CH2.1), CH2/PGA1 (U3_CH2_PGA1.16)
NetC31_CH2_2: CH2 (C31_CH2.2 R44_CH2.2), CH2/MIXER1 (U2_CH2_MIXER1.8)
NetC32_CH1_2: CH1 (C32_CH1.2 R45_CH1.2), CH1/MIXER2 (U2_CH1_MIXER2.8)
NetC32_CH2_2: CH2 (C32_CH2.2 R45_CH2.2), CH2/MIXER2 (U2_CH2_MIXER2.8)
NetR1_CH1_2: CH1 (R1_CH1.2), CH1/MIXER1 (R6_CH1_MIXER1.2 U2_CH1_MIXER1.5)
NetR1_CH2_2: CH2 (R1_CH2.2), CH2/MIXER1 (R6_CH2_MIXER1.2 U2_CH2_MIXER1.5)
NetR2_CH1_2: CH1 (R2_CH1.2), CH1/MIXER2 (R6_CH1_MIXER2.2 U2_CH1_MIXER2.5)
NetR2_CH2_2: CH2 (R2_CH2.2), CH2/MIXER2 (R6_CH2_MIXER2.2 U2_CH2_MIXER2.5)
VSIN_I_CH1: Analog_Channel_Test (R24.2 R25.1 R26.1), CH1/MIXER1 (U2_CH1_MIXER1.1)
VSIN_I_CH2: Analog_Channel_Test (R26.2 R27.1 R28.2), CH2/MIXER1 (U2_CH2_MIXER1.1)
VSIN_Q_CH1: Analog_Channel_Test (R18.1 R19.1 R23.2), CH1/MIXER2 (U2_CH1_MIXER2.1)
VSIN_Q_CH2: Analog_Channel_Test (R19.2 R22.1 R29.2), CH2/MIXER2 (U2_CH2_MIXER2.1)